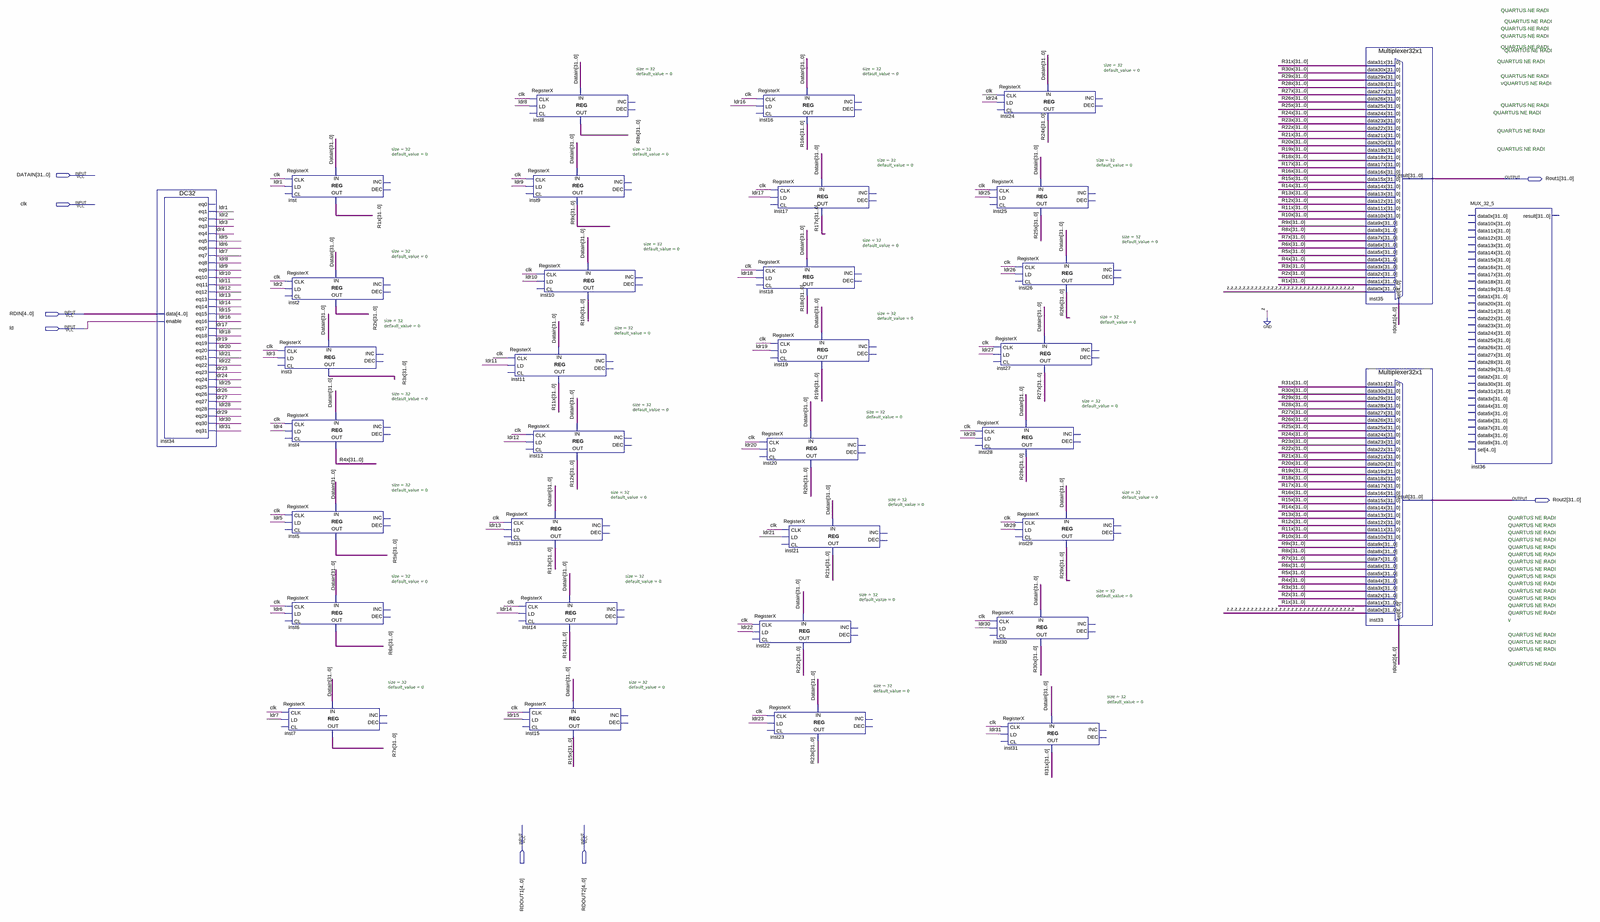
[diagram p0: schematic sheet, whole]
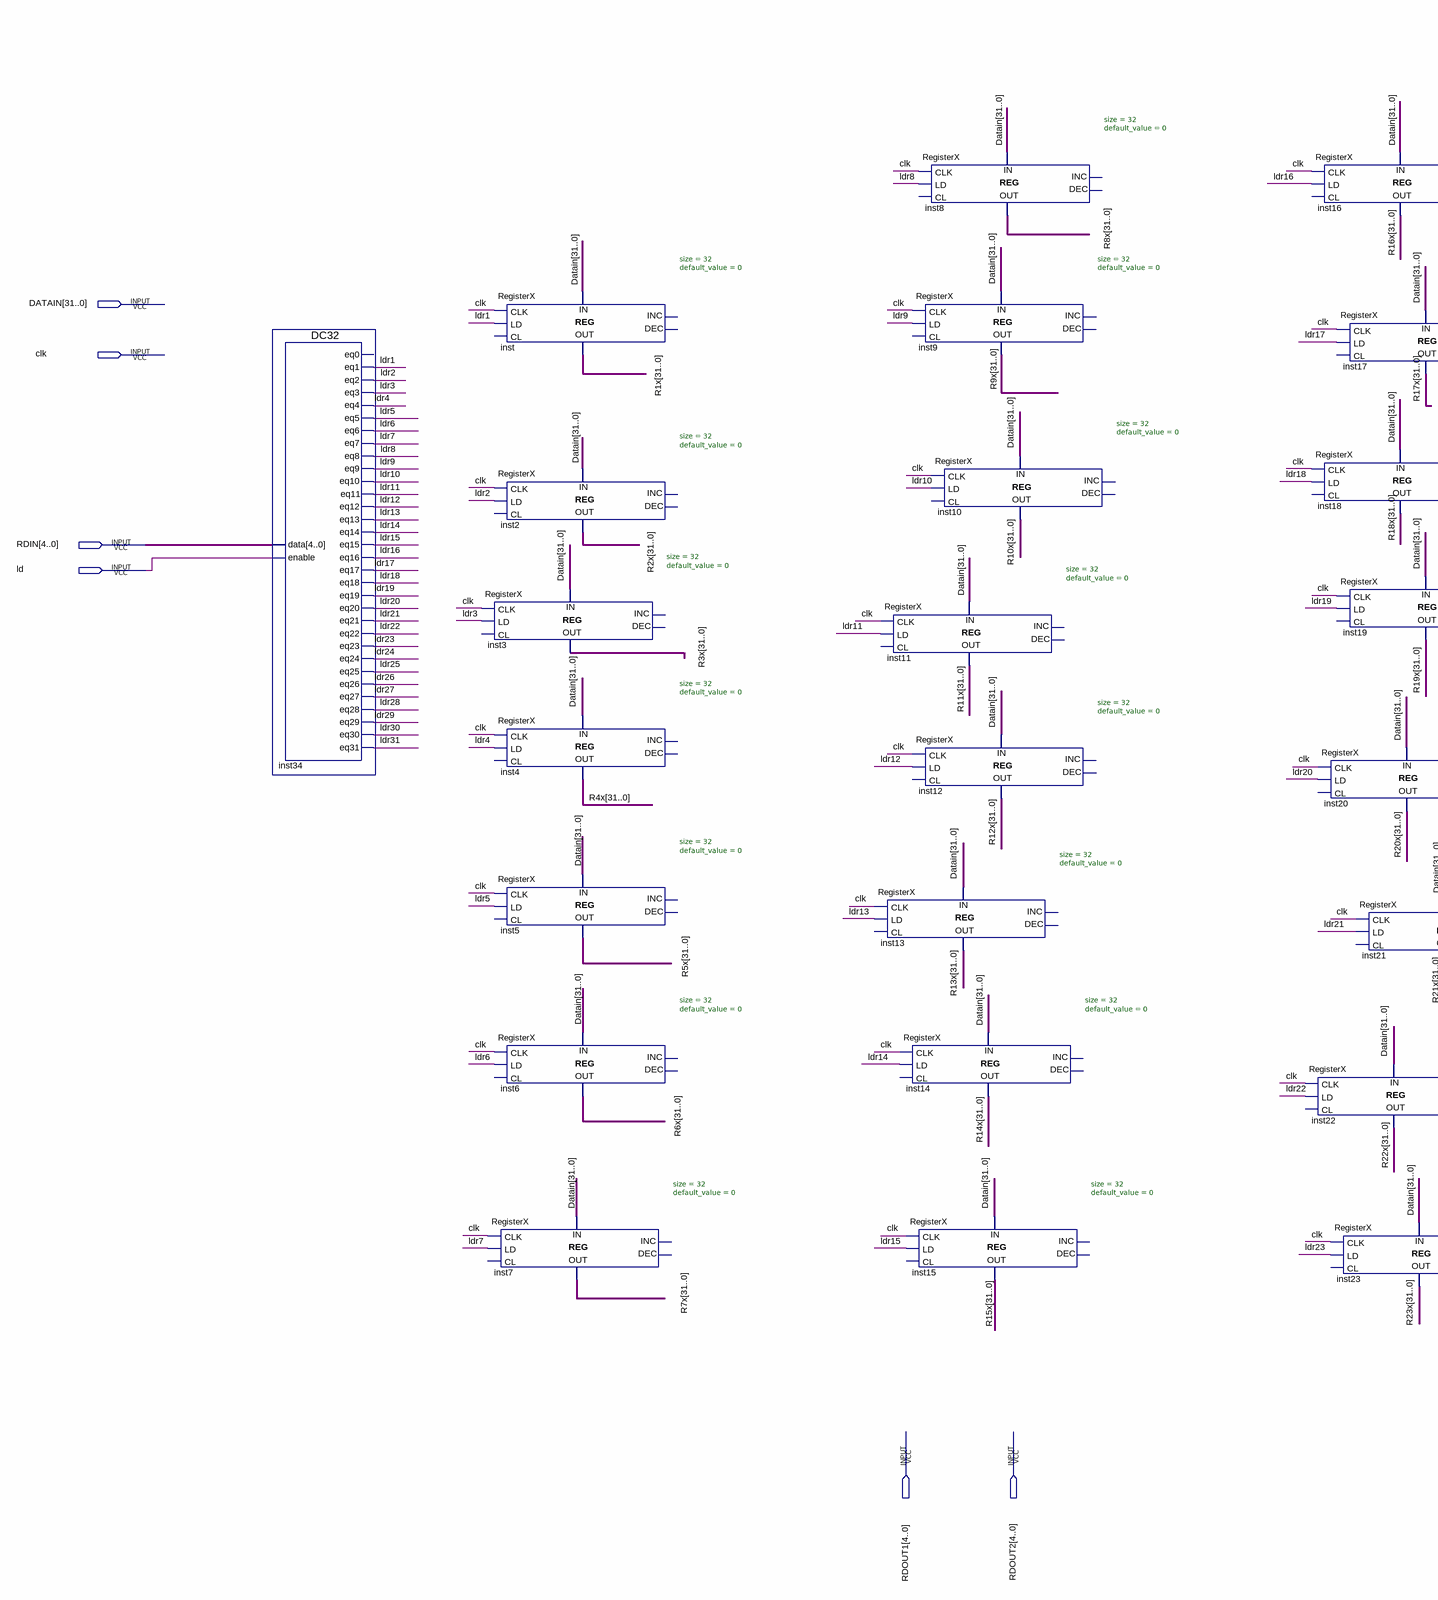
[diagram p1: schematic sheet, left part]
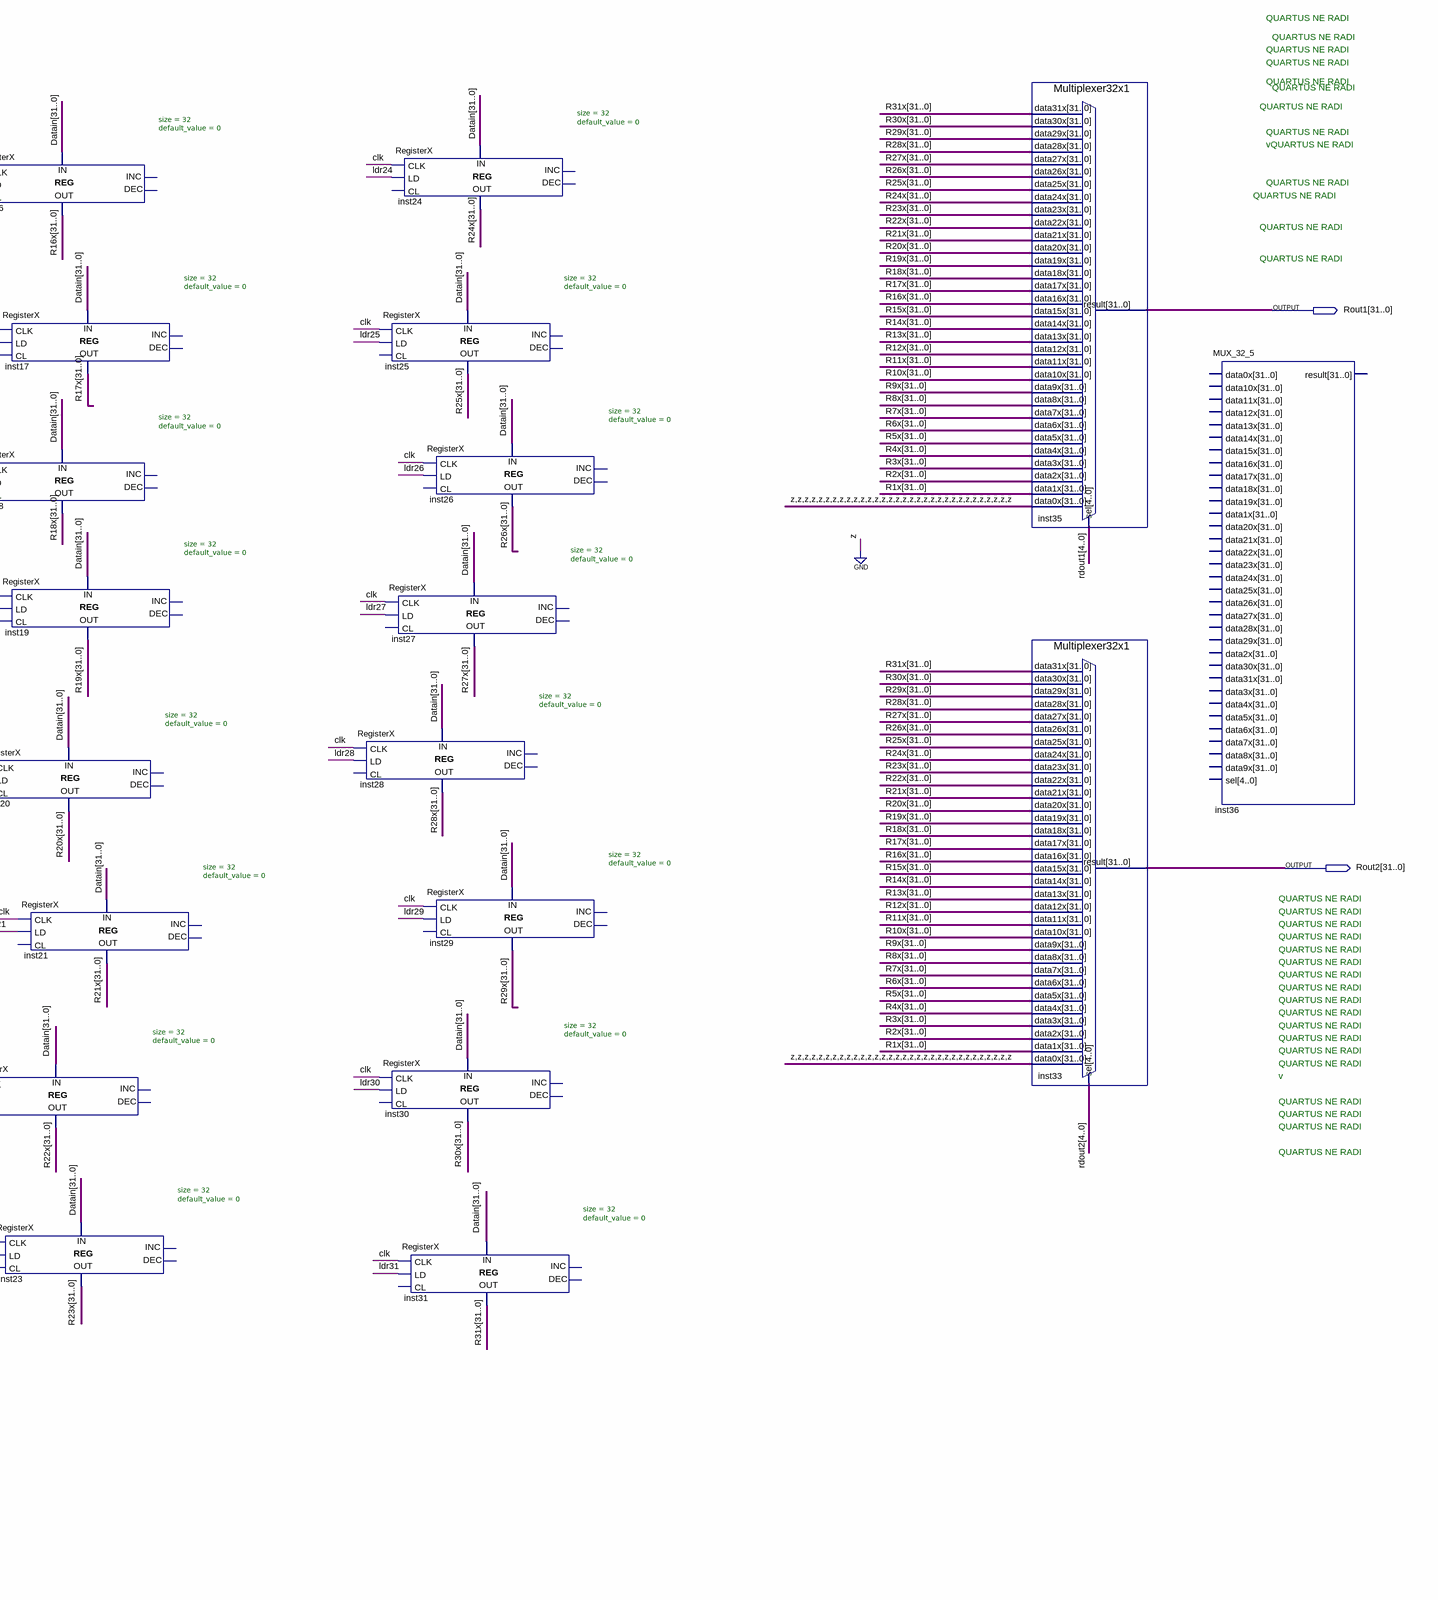
[diagram p2: schematic sheet, right part]
// Quartus schematic RegFile.bdf as structural Verilog: 35 symbols, 8 pins
module RegFile (
  input  [31:0] DATAIN,
  input  clk,
  input  [4:0] RDIN,
  input  ld,
  input  [4:0] RDOUT1,
  input  [4:0] RDOUT2,
  output [31:0] Rout1,
  output [31:0] Rout2
);

  wire ldr1, ldr2, ldr3, ldr4, ldr5, ldr6, ldr7, ldr8, ldr9, ldr10, ldr11, ldr12, ldr13, ldr14, ldr15, ldr16,
       ldr17, ldr18, ldr19, ldr20, ldr21, ldr22, ldr23, ldr24, ldr25, ldr26, ldr27, ldr28, ldr29, ldr30,
       ldr31;
  wire [31:0] R1x, R2x, R3x, R4x, R5x, R6x, R7x, R8x, R9x, R10x, R11x, R12x, R13x, R14x, R15x, R16x, R17x,
       R18x, R19x, R20x, R21x, R22x, R23x, R24x, R25x, R26x, R27x, R28x, R29x, R30x, R31x;

  DC32 inst34 (
    .data(RDIN), .enable(ld), .eq1(ldr1), .eq2(ldr2), .eq3(ldr3), .eq4(ldr4), .eq5(ldr5), .eq6(ldr6),
    .eq7(ldr7), .eq8(ldr8), .eq9(ldr9), .eq10(ldr10), .eq11(ldr11), .eq12(ldr12), .eq13(ldr13), .eq14(ldr14),
    .eq15(ldr15), .eq16(ldr16), .eq17(ldr17), .eq18(ldr18), .eq19(ldr19), .eq20(ldr20), .eq21(ldr21),
    .eq22(ldr22), .eq23(ldr23), .eq24(ldr24), .eq25(ldr25), .eq26(ldr26), .eq27(ldr27), .eq28(ldr28),
    .eq29(ldr29), .eq30(ldr30), .eq31(ldr31));  // open: eq0
  RegisterX #(.size(32), .default_value(0)) inst (
    .CLK(clk), .LD(ldr1), .DATA_IN(DATAIN), .DATA_OUT(R1x));  // open: CL, INC, DEC
  RegisterX #(.size(32), .default_value(0)) inst2 (
    .CLK(clk), .LD(ldr2), .DATA_IN(DATAIN), .DATA_OUT(R2x));  // open: CL, INC, DEC
  RegisterX #(.size(32), .default_value(0)) inst3 (
    .CLK(clk), .LD(ldr3), .DATA_IN(DATAIN), .DATA_OUT(R3x));  // open: CL, INC, DEC
  RegisterX #(.size(32), .default_value(0)) inst4 (
    .CLK(clk), .LD(ldr4), .DATA_IN(DATAIN), .DATA_OUT(R4x));  // open: CL, INC, DEC
  RegisterX #(.size(32), .default_value(0)) inst5 (
    .CLK(clk), .LD(ldr5), .DATA_IN(DATAIN), .DATA_OUT(R5x));  // open: CL, INC, DEC
  RegisterX #(.size(32), .default_value(0)) inst6 (
    .CLK(clk), .LD(ldr6), .DATA_IN(DATAIN), .DATA_OUT(R6x));  // open: CL, INC, DEC
  RegisterX #(.size(32), .default_value(0)) inst7 (
    .CLK(clk), .LD(ldr7), .DATA_IN(DATAIN), .DATA_OUT(R7x));  // open: CL, INC, DEC
  RegisterX #(.size(32), .default_value(0)) inst8 (
    .CLK(clk), .LD(ldr8), .DATA_IN(DATAIN), .DATA_OUT(R8x));  // open: CL, INC, DEC
  RegisterX #(.size(32), .default_value(0)) inst9 (
    .CLK(clk), .LD(ldr9), .DATA_IN(DATAIN), .DATA_OUT(R9x));  // open: CL, INC, DEC
  RegisterX #(.size(32), .default_value(0)) inst11 (
    .CLK(clk), .LD(ldr11), .DATA_IN(DATAIN), .DATA_OUT(R11x));  // open: CL, INC, DEC
  RegisterX #(.size(32), .default_value(0)) inst12 (
    .CLK(clk), .LD(ldr12), .DATA_IN(DATAIN), .DATA_OUT(R12x));  // open: CL, INC, DEC
  RegisterX #(.size(32), .default_value(0)) inst13 (
    .CLK(clk), .LD(ldr13), .DATA_IN(DATAIN), .DATA_OUT(R13x));  // open: CL, INC, DEC
  RegisterX #(.size(32), .default_value(0)) inst14 (
    .CLK(clk), .LD(ldr14), .DATA_IN(DATAIN), .DATA_OUT(R14x));  // open: CL, INC, DEC
  RegisterX #(.size(32), .default_value(0)) inst15 (
    .CLK(clk), .LD(ldr15), .DATA_IN(DATAIN), .DATA_OUT(R15x));  // open: CL, INC, DEC
  RegisterX #(.size(32), .default_value(0)) inst10 (
    .CLK(clk), .LD(ldr10), .DATA_IN(DATAIN), .DATA_OUT(R10x));  // open: CL, INC, DEC
  RegisterX #(.size(32), .default_value(0)) inst16 (
    .CLK(clk), .LD(ldr16), .DATA_IN(DATAIN), .DATA_OUT(R16x));  // open: CL, INC, DEC
  RegisterX #(.size(32), .default_value(0)) inst18 (
    .CLK(clk), .LD(ldr18), .DATA_IN(DATAIN), .DATA_OUT(R18x));  // open: CL, INC, DEC
  RegisterX #(.size(32), .default_value(0)) inst20 (
    .CLK(clk), .LD(ldr20), .DATA_IN(DATAIN), .DATA_OUT(R20x));  // open: CL, INC, DEC
  RegisterX #(.size(32), .default_value(0)) inst22 (
    .CLK(clk), .LD(ldr22), .DATA_IN(DATAIN), .DATA_OUT(R22x));  // open: CL, INC, DEC
  RegisterX #(.size(32), .default_value(0)) inst17 (
    .CLK(clk), .LD(ldr17), .DATA_IN(DATAIN), .DATA_OUT(R17x));  // open: CL, INC, DEC
  RegisterX #(.size(32), .default_value(0)) inst19 (
    .CLK(clk), .LD(ldr19), .DATA_IN(DATAIN), .DATA_OUT(R19x));  // open: CL, INC, DEC
  RegisterX #(.size(32), .default_value(0)) inst21 (
    .CLK(clk), .LD(ldr21), .DATA_IN(DATAIN), .DATA_OUT(R21x));  // open: CL, INC, DEC
  RegisterX #(.size(32), .default_value(0)) inst23 (
    .CLK(clk), .LD(ldr23), .DATA_IN(DATAIN), .DATA_OUT(R23x));  // open: CL, INC, DEC
  RegisterX #(.size(32), .default_value(0)) inst24 (
    .CLK(clk), .LD(ldr24), .DATA_IN(DATAIN), .DATA_OUT(R24x));  // open: CL, INC, DEC
  RegisterX #(.size(32), .default_value(0)) inst25 (
    .CLK(clk), .LD(ldr25), .DATA_IN(DATAIN), .DATA_OUT(R25x));  // open: CL, INC, DEC
  RegisterX #(.size(32), .default_value(0)) inst27 (
    .CLK(clk), .LD(ldr27), .DATA_IN(DATAIN), .DATA_OUT(R27x));  // open: CL, INC, DEC
  RegisterX #(.size(32), .default_value(0)) inst28 (
    .CLK(clk), .LD(ldr28), .DATA_IN(DATAIN), .DATA_OUT(R28x));  // open: CL, INC, DEC
  RegisterX #(.size(32), .default_value(0)) inst30 (
    .CLK(clk), .LD(ldr30), .DATA_IN(DATAIN), .DATA_OUT(R30x));  // open: CL, INC, DEC
  RegisterX #(.size(32), .default_value(0)) inst26 (
    .CLK(clk), .LD(ldr26), .DATA_IN(DATAIN), .DATA_OUT(R26x));  // open: CL, INC, DEC
  RegisterX #(.size(32), .default_value(0)) inst29 (
    .CLK(clk), .LD(ldr29), .DATA_IN(DATAIN), .DATA_OUT(R29x));  // open: CL, INC, DEC
  RegisterX #(.size(32), .default_value(0)) inst31 (
    .CLK(clk), .LD(ldr31), .DATA_IN(DATAIN), .DATA_OUT(R31x));  // open: CL, INC, DEC
  Multiplexer32x1 inst35 (
    .data31x(R31x), .data30x(R30x), .data29x(R29x), .data28x(R28x), .data27x(R27x), .data26x(R26x),
    .data25x(R25x), .data24x(R24x), .data23x(R23x), .data22x(R22x), .data21x(R21x), .data20x(R20x),
    .data19x(R19x), .data18x(R18x), .data17x(R17x), .data16x(R16x), .data15x(R15x), .data14x(R14x),
    .data13x(R13x), .data12x(R12x), .data11x(R11x), .data10x(R10x), .data9x(R9x), .data8x(R8x), .data7x(R7x),
    .data6x(R6x), .data5x(R5x), .data4x(R4x), .data3x(R3x), .data2x(R2x), .data1x(R1x), .data0x({32{1'b0}}),
    .sel(RDOUT1), .result(Rout1));
  Multiplexer32x1 inst33 (
    .data31x(R31x), .data30x(R30x), .data29x(R29x), .data28x(R28x), .data27x(R27x), .data26x(R26x),
    .data25x(R25x), .data24x(R24x), .data23x(R23x), .data22x(R22x), .data21x(R21x), .data20x(R20x),
    .data19x(R19x), .data18x(R18x), .data17x(R17x), .data16x(R16x), .data15x(R15x), .data14x(R14x),
    .data13x(R13x), .data12x(R12x), .data11x(R11x), .data10x(R10x), .data9x(R9x), .data8x(R8x), .data7x(R7x),
    .data6x(R6x), .data5x(R5x), .data4x(R4x), .data3x(R3x), .data2x(R2x), .data1x(R1x), .data0x({32{1'b0}}),
    .sel(RDOUT2), .result(Rout2));
  MUX_32_5 inst36 ();  // open: data0x, data10x, data11x, data12x, data13x, data14x, data15x, data16x, data17x, data18x, data19x, data1x, data20x, data21x, data22x, data23x, data24x, data25x, data26x, data27x, data28x, data29x, data2x, data30x, data31x, data3x, data4x, data5x, data6x, data7x, data8x, data9x, sel, result

  // Notes on the sheet:
  //   QUARTUS NE RADI
  //   QUARTUS NE RADI
  //   QUARTUS NE RADI
  //   QUARTUS NE RADI
  //   QUARTUS NE RADI
  //   QUARTUS NE RADI
  //   QUARTUS NE RADI
  //   QUARTUS NE RADI
  //   vQUARTUS NE RADI
  //   QUARTUS NE RADI
  //   QUARTUS NE RADI
  //   QUARTUS NE RADI
  //   QUARTUS NE RADI
  //   QUARTUS NE RADI
  //   QUARTUS NE RADI
  //   QUARTUS NE RADI
  //   QUARTUS NE RADI
  //   QUARTUS NE RADI
  //   QUARTUS NE RADI
  //   QUARTUS NE RADI
  //   QUARTUS NE RADI
  //   QUARTUS NE RADI
  //   QUARTUS NE RADI
  //   QUARTUS NE RADI
  //   QUARTUS NE RADI
  //   QUARTUS NE RADI
  //   QUARTUS NE RADI
  //   v
  //   QUARTUS NE RADI
  //   QUARTUS NE RADI
  //   QUARTUS NE RADI
  //   QUARTUS NE RADI
endmodule
